# Altium project PLC_Controller Card.PrjPcb (part 1 of 2)
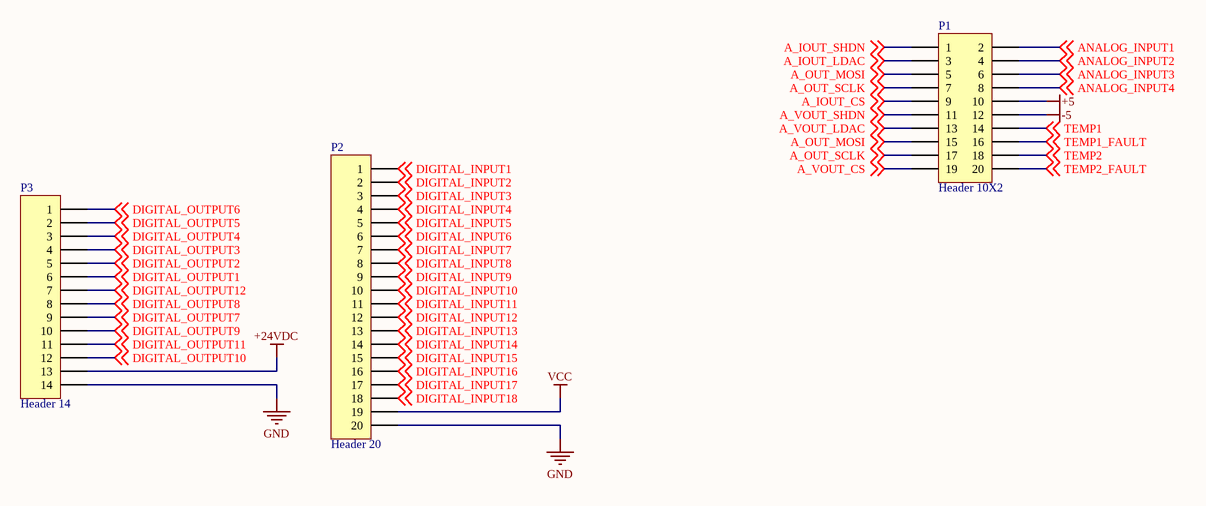
[diagram p0: Communication_with_IO.SchDoc]
8 sheets, 177 parts. Net scope: global (net labels, ports and power ports of the same name join across sheets).
Board file: Controller_PCB.PcbDoc
Sheets:
  Communication_with_IO.SchDoc
  GSM.SchDoc
  ANT.SchDoc
  GSM_INDICATION.SchDoc
  MCU.SchDoc
  Peripherals.SchDoc
  Power_supply.SchDoc
  SIM CARD.SchDoc

## Sheet Communication_with_IO.SchDoc
size A4; SheetNumber: 1; SheetTotal: 9

### Parts
P1  Header 10X2  [HDR2X10]
P2  Header 20  [HDR1X20]
P3  Header 14  [HDR1X14]

### Nets
+5: P1.10
+24VDC: P3.13
-5: P1.12
GND: P2.20 P3.14
VCC: P2.19
A_IOUT_CS: P1.9 ; off-sheet A_IOUT_CS
A_IOUT_LDAC: P1.3 ; off-sheet A_IOUT_LDAC
A_IOUT_SHDN: P1.1 ; off-sheet A_IOUT_SHDN
A_OUT_MOSI: P1.5 P1.15 ; off-sheet A_OUT_MOSI
A_OUT_SCLK: P1.7 P1.17 ; off-sheet A_OUT_SCLK
A_VOUT_CS: P1.19 ; off-sheet A_VOUT_CS
A_VOUT_LDAC: P1.13 ; off-sheet A_VOUT_LDAC
A_VOUT_SHDN: P1.11 ; off-sheet A_VOUT_SHDN
ANALOG_INPUT1: P1.2 ; off-sheet ANALOG_INPUT1
ANALOG_INPUT2: P1.4 ; off-sheet ANALOG_INPUT2
ANALOG_INPUT3: P1.6 ; off-sheet ANALOG_INPUT3
ANALOG_INPUT4: P1.8 ; off-sheet ANALOG_INPUT4
DIGITAL_INPUT1: P2.1 ; off-sheet DIGITAL_INPUT1
DIGITAL_INPUT2: P2.2 ; off-sheet DIGITAL_INPUT2
DIGITAL_INPUT3: P2.3 ; off-sheet DIGITAL_INPUT3
DIGITAL_INPUT4: P2.4 ; off-sheet DIGITAL_INPUT4
DIGITAL_INPUT5: P2.5 ; off-sheet DIGITAL_INPUT5
DIGITAL_INPUT6: P2.6 ; off-sheet DIGITAL_INPUT6
DIGITAL_INPUT7: P2.7 ; off-sheet DIGITAL_INPUT7
DIGITAL_INPUT8: P2.8 ; off-sheet DIGITAL_INPUT8
DIGITAL_INPUT9: P2.9 ; off-sheet DIGITAL_INPUT9
DIGITAL_INPUT10: P2.10 ; off-sheet DIGITAL_INPUT10
DIGITAL_INPUT11: P2.11 ; off-sheet DIGITAL_INPUT11
DIGITAL_INPUT12: P2.12 ; off-sheet DIGITAL_INPUT12
DIGITAL_INPUT13: P2.13 ; off-sheet DIGITAL_INPUT13
DIGITAL_INPUT14: P2.14 ; off-sheet DIGITAL_INPUT14
DIGITAL_INPUT15: P2.15 ; off-sheet DIGITAL_INPUT15
DIGITAL_INPUT16: P2.16 ; off-sheet DIGITAL_INPUT16
DIGITAL_INPUT17: P2.17 ; off-sheet DIGITAL_INPUT17
DIGITAL_INPUT18: P2.18 ; off-sheet DIGITAL_INPUT18
DIGITAL_OUTPUT1: P3.6 ; off-sheet DIGITAL_OUTPUT1
DIGITAL_OUTPUT2: P3.5 ; off-sheet DIGITAL_OUTPUT2
DIGITAL_OUTPUT3: P3.4 ; off-sheet DIGITAL_OUTPUT3
DIGITAL_OUTPUT4: P3.3 ; off-sheet DIGITAL_OUTPUT4
DIGITAL_OUTPUT5: P3.2 ; off-sheet DIGITAL_OUTPUT5
DIGITAL_OUTPUT6: P3.1 ; off-sheet DIGITAL_OUTPUT6
DIGITAL_OUTPUT7: P3.9 ; off-sheet DIGITAL_OUTPUT7
DIGITAL_OUTPUT8: P3.8 ; off-sheet DIGITAL_OUTPUT8
DIGITAL_OUTPUT9: P3.10 ; off-sheet DIGITAL_OUTPUT9
DIGITAL_OUTPUT10: P3.12 ; off-sheet DIGITAL_OUTPUT10
DIGITAL_OUTPUT11: P3.11 ; off-sheet DIGITAL_OUTPUT11
DIGITAL_OUTPUT12: P3.7 ; off-sheet DIGITAL_OUTPUT12
TEMP1: P1.14 ; off-sheet TEMP1
TEMP1_FAULT: P1.16 ; off-sheet TEMP1_FAULT
TEMP2: P1.18 ; off-sheet TEMP2
TEMP2_FAULT: P1.20 ; off-sheet TEMP2_FAULT

### Library data of the parts
P1 = Header 10X2: Header, 10-Pin, Dual row; LatestRevisionDate: 17-Jul-2002; LatestRevisionNote: Re-released for DXP Platform.; Publisher: Altium Limited
P2 = Header 20: Header, 20-Pin; LatestRevisionDate: 17-Jul-2002; LatestRevisionNote: Re-released for DXP Platform.; Publisher: Altium Limited
P3 = Header 14: Header, 14-Pin; LatestRevisionDate: 17-Jul-2002; LatestRevisionNote: Re-released for DXP Platform.; Publisher: Altium Limited

## Sheet GSM.SchDoc: IoT_Gateway
size A4; Date: *******; ApprovedBy: *******; CheckedBy: Parth Patel; Author: *******; CompanyName: *******; DrawnBy: Parth Patel; Engineer: *******; Organization: *******; Address1: *******; Address2: *******; Address3: *******; Address4: *******; DocumentNumber: 1; Revision: *******; SheetNumber: 2; SheetTotal: 9; Version: V1.0.0; CurrentTime: *******; CurrentDate: *******; Time: *******; DocumentFullPathAndName: *******; DocumentName: *******; ModifiedDate: *******; ImagePath: *******; ProjectName: *******; Application_BuildNumber: *******
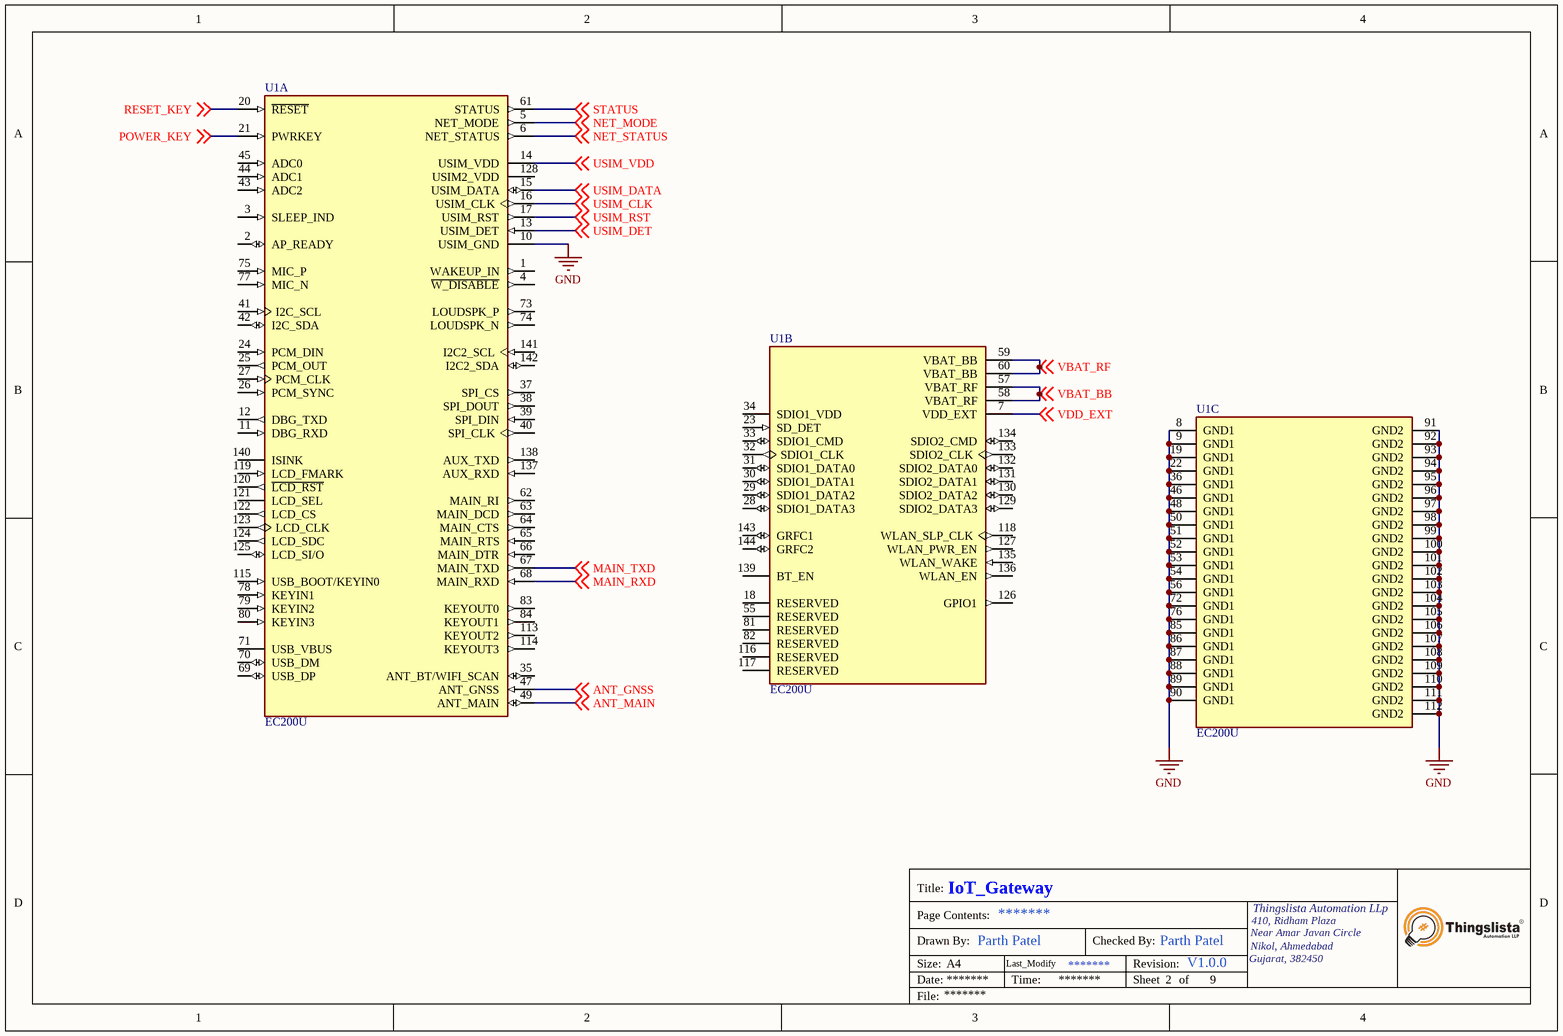
[diagram p1: GSM.SchDoc]

### Parts
U1  EC200U  [XCVR_EC200U]  (parts A,B,C of 3)

### Nets
GND: U1.8(GND1) U1.9(GND1) U1.10(USIM_GND) U1.19(GND1) U1.22(GND1) U1.36(GND1) U1.46(GND1) U1.48(GND1) U1.50(GND1) U1.51(GND1) U1.52(GND1) U1.53(GND1) U1.54(GND1) U1.56(GND1) U1.72(GND1) U1.76(GND1) U1.85(GND1) U1.86(GND1) U1.87(GND1) U1.88(GND1) U1.89(GND1) U1.90(GND1) U1.91(GND2) U1.92(GND2) U1.93(GND2) U1.94(GND2) U1.95(GND2) U1.96(GND2) U1.97(GND2) U1.98(GND2) U1.99(GND2) U1.100(GND2) U1.101(GND2) U1.102(GND2) U1.103(GND2) U1.104(GND2) U1.105(GND2) U1.106(GND2) U1.107(GND2) U1.108(GND2) U1.109(GND2) U1.110(GND2) U1.111(GND2) U1.112(GND2)
ANT_GNSS: U1.47(ANT_GNSS) ; off-sheet ANT_GNSS
ANT_MAIN: U1.49(ANT_MAIN) ; off-sheet ANT_MAIN
MAIN_RXD: U1.68(MAIN_RXD) ; off-sheet MAIN_RXD
MAIN_TXD: U1.67(MAIN_TXD) ; off-sheet MAIN_TXD
NET_MODE: U1.5(NET_MODE) ; off-sheet NET_MODE
NET_STATUS: U1.6(NET_STATUS) ; off-sheet NET_STATUS
POWER_KEY: U1.21(PWRKEY) ; off-sheet POWER_KEY
RESET_KEY: U1.20(~{RESET}) ; off-sheet RESET_KEY
STATUS: U1.61(STATUS) ; off-sheet STATUS
USIM_CLK: U1.16(USIM_CLK) ; off-sheet USIM_CLK
USIM_DATA: U1.15(USIM_DATA) ; off-sheet USIM_DATA
USIM_DET: U1.13(USIM_DET) ; off-sheet USIM_DET
USIM_RST: U1.17(USIM_RST) ; off-sheet USIM_RST
USIM_VDD: U1.14(USIM_VDD) ; off-sheet USIM_VDD
VBAT_BB: U1.57(VBAT_RF) U1.58(VBAT_RF) U1.59(VBAT_BB) U1.60(VBAT_BB) ; off-sheet VBAT_RF, off-sheet VBAT_BB  [also labelled VBAT_RF]
VDD_EXT: U1.7(VDD_EXT) ; off-sheet VDD_EXT

Not connected (* = marked no-connect by the designer): U1 1(WAKEUP_IN) 2(AP_READY) 3(SLEEP_IND) 4(~{W_DISABLE}) 11(DBG_RXD) 12(DBG_TXD) 18(RESERVED) 23(SD_DET) 24(PCM_DIN) 25(PCM_OUT) 26(PCM_SYNC) 27(PCM_CLK) 28(SDIO1_DATA3) 29(SDIO1_DATA2) 30(SDIO1_DATA1) 31(SDIO1_DATA0) 32(SDIO1_CLK) 33(SDIO1_CMD) 34(SDIO1_VDD) 35(ANT_BT/WIFI_SCAN) 37(SPI_CS) 38(SPI_DOUT) 39(SPI_DIN) 40(SPI_CLK) 41(I2C_SCL) 42(I2C_SDA) 43(ADC2) 44(ADC1) 45(ADC0) 55(RESERVED) 62(MAIN_RI) 63(MAIN_DCD) 64(MAIN_CTS) 65(MAIN_RTS) 66(MAIN_DTR) 69(USB_DP) 70(USB_DM) 71(USB_VBUS) 73(LOUDSPK_P) 74(LOUDSPK_N) 75(MIC_P) 77(MIC_N) 78(KEYIN1) 79(KEYIN2) 80(KEYIN3) 81(RESERVED) 82(RESERVED) 83(KEYOUT0) 84(KEYOUT1) 113(KEYOUT2) 114(KEYOUT3) 115(USB_BOOT/KEYIN0) 116(RESERVED) 117(RESERVED) 118(WLAN_SLP_CLK) 119(LCD_FMARK) 120(~{LCD_RST}) 121(LCD_SEL) 122(LCD_CS) 123(LCD_CLK) 124(LCD_SDC) 125(LCD_SI/O) 126(GPIO1) 127(WLAN_PWR_EN) 128(USIM2_VDD) 129(SDIO2_DATA3) 130(SDIO2_DATA2) 131(SDIO2_DATA1) 132(SDIO2_DATA0) 133(SDIO2_CLK) 134(SDIO2_CMD) 135(WLAN_WAKE) 136(WLAN_EN) 137(AUX_RXD) 138(AUX_TXD) 139(BT_EN) 140(ISINK) 141(I2C2_SCL) 142(I2C2_SDA) 143(GRFC1) 144(GRFC2)

### Notes on the sheet
- Title:
- Page Contents:
- 410, Ridham Plaza
- Thingslista Automation LLp
- Size:
- Date:
- File:
- Drawn By:
- A4
- Last_Modify
- Time:
- Checked By:
- Revision:
- Sheet
- of
- Gujarat, 382450
- Near Amar Javan Circle
- Nikol, Ahmedabad

### Library data of the parts
U1 = EC200U: Package: None; Price: None; Value: *; MP: EC200U; Availability: Unavailable

## Sheet ANT.SchDoc: Title
size A4; Date: *******; ApprovedBy: *******; CheckedBy: None; Author: *******; CompanyName: *******; DrawnBy: Name; Engineer: *******; Organization: *******; Address1: *******; Address2: *******; Address3: *******; Address4: *******; DocumentNumber: 5; Revision: *******; SheetNumber: 3; SheetTotal: 9; CurrentTime: *******; CurrentDate: *******; Time: *******; DocumentFullPathAndName: *******; DocumentName: *******; ModifiedDate: *******; ImagePath: *******; ProjectName: *******; Application_BuildNumber: *******
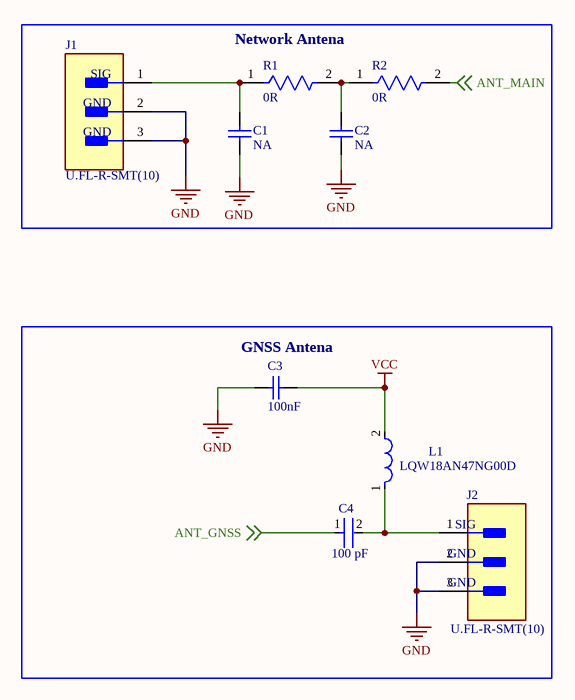
[diagram p2: ANT.SchDoc]

### Parts
C1  NA  [CAPC2013X145X50ML20T25]
C2  NA  [CAPC2013X145X50ML20T25]
C3  Capacitance: 100nF  [CAPC2013X135X45ML10T25]  (hidden comment: GRM21BR71H104KA01L)
C4  Capacitance: 100 pF  [FP-C0805C-DN-MFG]  (hidden comment: C0805C101J1GACTU)
J1  U.FL-R-SMT(10)  [FP-U_FL-R-SMT_10-MFG]
J2  U.FL-R-SMT(10)  [FP-U_FL-R-SMT_10-MFG]
L1  LQW18AN47NG00D  [FP-LQW18AN_00-MFG]
R1  0R  [FP-CRCW0805-e3-IPC_B]
R2  0R  [FP-CRCW0805-e3-IPC_B]

### Blocks framed on the sheet
Network Antena: C1 C2 J1 R1 R2
GNSS Antena: C3 C4 J2 L1

### Nets
GND: C1.1 C2.1 C3.1 J1.2(GND) J1.3(GND) J2.2(GND) J2.3(GND)
VCC: C3.2 L1.2
ANT_GNSS: C4.1 ; off-sheet ANT_GNSS
ANT_MAIN: R2.2 ; off-sheet ANT_MAIN
NetC1_2: C1.2 J1.1(SIG) R1.1
NetC2_2: C2.2 R1.2 R2.1
NetC4_2: C4.2 J2.1(SIG) L1.1

### Notes on the sheet
- Title:
- Page Contents:
- 410, Ridham Plaza
- Thingslista Automation LLp
- Size:
- Date:
- File:
- Drawn By:
- A4
- Last_Modify
- Time:
- Checked By:
- Revision:
- Sheet
- of
- Gujarat, 382450
- Near Amar Javan Circle
- Nikol, Ahmedabad

### Library data of the parts
C1 C2 = CMP-1036-04819-2: Part Number: C0805C225K9PACTU; Manufacturer: Kemet
C3 = CMP-2100-03644-1: Chip Capacitor, 0.1 uF, +/- 10%, 50 V, -55 to 125 degC, 0805 (2012 Metric), RoHS, Tape and Reel; Manufacturer: Murata; Voltage: 50V; Insulation Resistance: 10GR; Dielectric Material: Ceramic; Dielectric: X7R; Package Description: 2-Pin Surface Mount Device, Body 2 x 1.25 mm; Manufacturer URL: http://www.murata.com/; Case Code (Imperial): 0805; Datasheet URL: http://psearch.en.murata.com/capacitor/product/GRM21BR71H104KA01%23.pdf; Termination: SMD/SMT; Lead Free: LeadFree; Package Quantity: 1; Mount: SurfaceMount; REACH SVHC: Unknown; Thickness: 0.053inch; Height: 1.25mm; Case/Package: 0805; Voltage Rating: 50V; Width: 0.049inch; Case Code (Metric): 2012; Material: Ceramic; Min Operating Temperature: -55degC; RoHSCompliant: true; Datasheet Version: 42675.0; Voltage Rating (DC): 50V; Tolerance: 10%; Package Reference: 0805; Depth: 1.25mm; Length: 2mm; Max Operating Temperature: 125degC; Packaging: TapeandReel; Number of Pins: 2; Radiation Hardening: No
C4 = CMP-03020-014281-1: CAP CER 100PF 100V C0G/NP0 0805; Manufacturer: KEMET; Temperature Coefficient: 30ppm/°C; Temperature Characteristic: C0G; Material: Ceramic; Tolerance: 0.05; RoHS: TRUE; ComponentLink2URL: https://content.kemet.com/datasheets/KEM_C1003_C0G_SMD.pdf; Voltage Rating: 100 V; Height: 0.88mm; Device Class L3: Ceramic Capacitors; Temperature: -55°C to +125°C; Manufacturer Part Number: C0805C101J1GACTU; Digikey Description: CAP CER 100PF 100V C0G/NP0 0805; Device Class L1: Passive Components; Lead Free: Yes; Package: C0805C-DN; Octopart: https://octopart.com/c0805c101j1gactu-kemet-123666; Automotive: No; Category: Cap; Temperature Range High: +125°C; Mouser Description: Multilayer Ceramic Capacitors MLCC - SMD/SMT 100volts 100pF C0G 5%; Temperature Range Low: -55°C; ComponentLink2Description: Datasheet; Ipc Land Pattern Name: CAPC200125X78; Device Class L2: Capacitors; Value: 100 pF
J1 J2 = CMP-0029-00003-2: CONN U.FL RCPT STR 50 OHM SMD; Plating: Silver; Connector Type: Coaxial; Frequency: 6GHz; Impedance: 50R; Body Material: Bronze; Dielectric Material: Polymer; Contact Plating: Gold; Termination: Solder; Orientation: Vertical; Contact Material: Brass; Min Operating Temperature: -40°C; Mount: Surface Mount; Lead Free: Lead Free; Max Operating Temperature: 90°C; Radiation Hardening: No; Packaging: Tape and Reel; Body Plating: Silver; Fastening Type: Snap; Max Frequency: 6GHz; Depth: 3.1mm; Package Quantity: 1; Case/Package: SMD/SMT; Housing Color: Beige; Length: 3mm
L1 = CMP-06042-007966-1: Wire Wound RF Inductor 47nH ±2% 380mA 0.29Ω 0603 (1608); Self Resonant Frequency: 2.6GHz; DC Resistance (DCR): 290mR; Test Frequency: 100MHz; Q Factor: 38; Shielding: Unshielded; Current: 340mA; Core Material: Non-Magnetic; Weight: 0.000106oz; Depth: 1mm; Resistor Type: Wirewound; Max Operating Temperature: 125°C; Inductance: 47nH; Mount: Surface Mount; DC Current: 380mA; Tolerance: 2%; Height - Seated (Max): 0.039inch; Height: 0.8mm; Radiation Hardening: No; Package Quantity: 4000; Case/Package: 0603; Military Standard: Not; Series Resistance: 290mR; Termination: SMD/SMT; Max DC Current: 380mA; Packaging: Tape and Reel; Min Operating Temperature: -55°C; Case Code (Metric): 1608; REACH SVHC: No SVHC; Lead Free: Lead Free; Inductance Tolerance: 2%; Case Code (Imperial): 0603; Length: 1.6mm; Width: 0.8mm; Number of Pins: 2; Current Rating: 380mA
R1 R2 = CMP-2001-04897-2: RES Thick Film, 0Ω, 0.125W, 0805; Power Rating: 125mW; Resistance: 0mR; Voltage Rating: 150V; Length: 2mm; Width: 0.049inch; Weight: 0.000194oz; Composition: Thick Film; Contact Plating: Tin; Max Power Dissipation: 125mW; Min Operating Temperature: -55°C; Packaging: Tape and Reel; Number of Terminations: 2; Package Quantity: 10000; Case Code (Imperial): 0805; Military Standard: Not; Height: 0.02inch; Features: Automotive AEC-Q200; Depth: 1.25mm; Radiation Hardening: No; Lead Free: Lead Free; Case Code (Metric): 2012; Case/Package: 0805; Voltage Rating (DC): 150V; Termination: SMD/SMT; Max Operating Temperature: 155°C

## Sheet GSM_INDICATION.SchDoc: Title
size A4; Date: *******; ApprovedBy: *******; CheckedBy: None; Author: *******; CompanyName: *******; DrawnBy: Name; Engineer: *******; Organization: *******; Address1: *******; Address2: *******; Address3: *******; Address4: *******; DocumentNumber: 3; Revision: *******; SheetNumber: 4; SheetTotal: 9; CurrentTime: *******; CurrentDate: *******; Time: *******; DocumentFullPathAndName: *******; DocumentName: *******; ModifiedDate: *******; ImagePath: *******; ProjectName: *******; Application_BuildNumber: *******
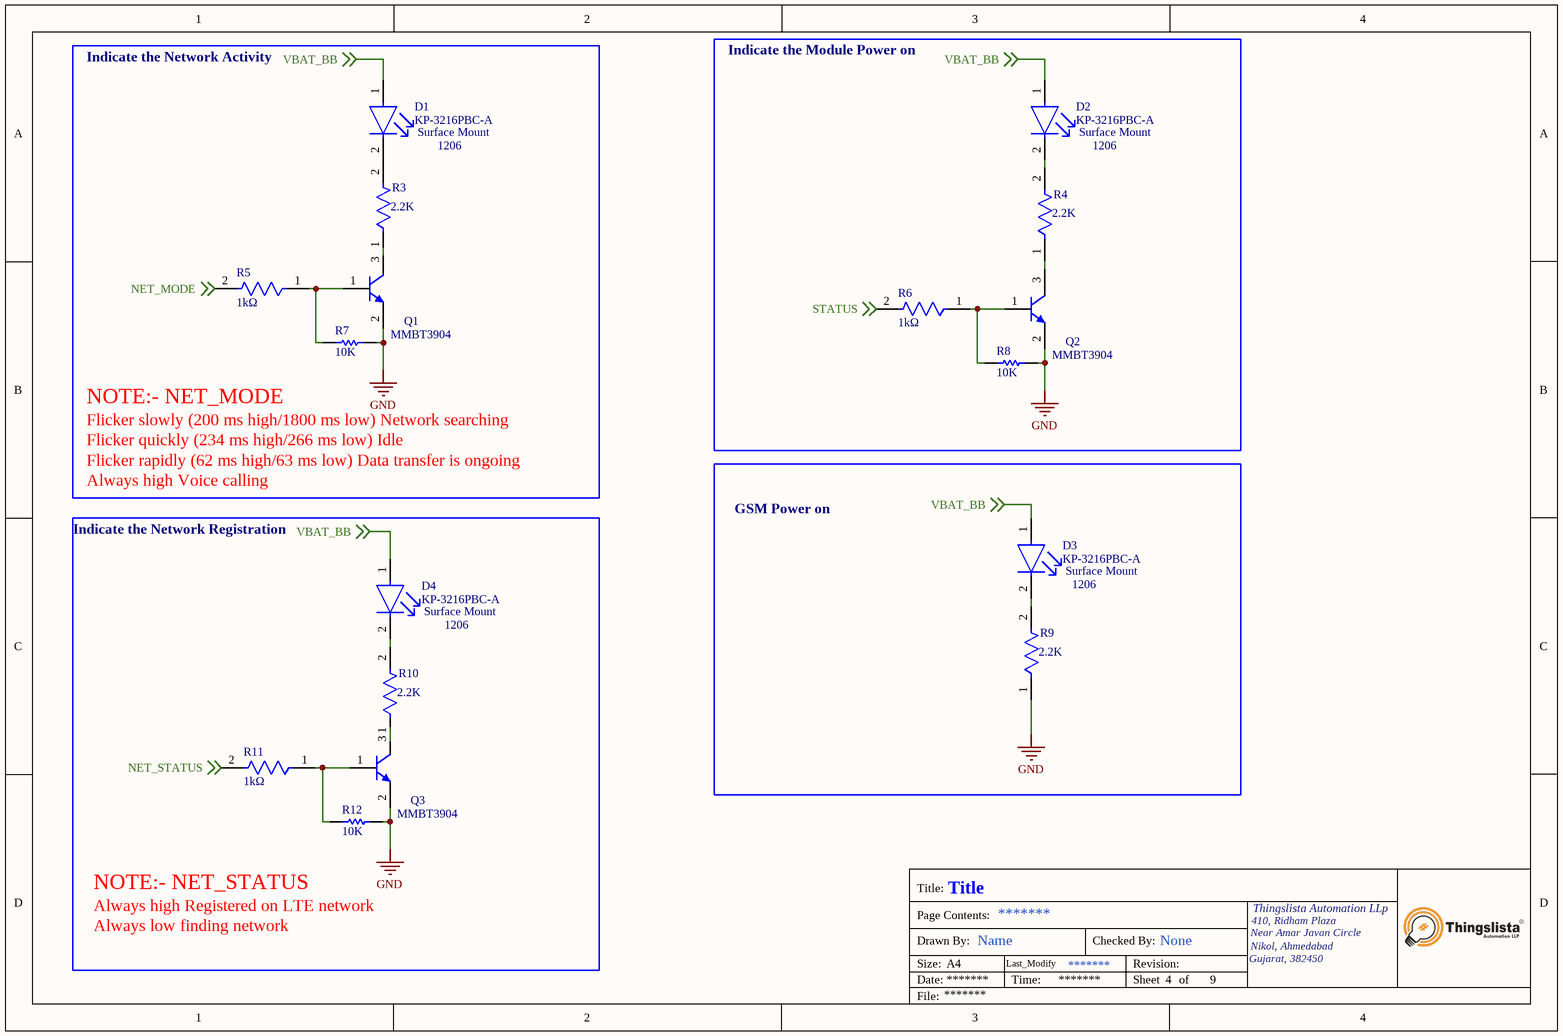
[diagram p3: GSM_INDICATION.SchDoc]

### Parts
D1  KP-3216PBC-A  Series: 1206  Mount: Surface Mount  [FP-KP-3216PBC-A-MFG]
D2  KP-3216PBC-A  Series: 1206  Mount: Surface Mount  [FP-KP-3216PBC-A-MFG]
D3  KP-3216PBC-A  Series: 1206  Mount: Surface Mount  [FP-KP-3216PBC-A-MFG]
D4  KP-3216PBC-A  Series: 1206  Mount: Surface Mount  [FP-KP-3216PBC-A-MFG]
Q1  MMBT3904  [FAIR-SOT23-3_V]
Q2  MMBT3904  [FAIR-SOT23-3_V]
Q3  MMBT3904  [FAIR-SOT23-3_V]
R3  Resistance: 2.2K  [FP-CRCW0805-e3-IPC_B]  (hidden comment: CRCW08052K20FKEA)
R4  Resistance: 2.2K  [FP-CRCW0805-e3-IPC_B]  (hidden comment: CRCW08052K20FKEA)
R5  Resistance: 1kΩ  [FP-CRG0805-IPC_A]  (hidden comment: CRG0805F1K0)
R6  Resistance: 1kΩ  [FP-CRG0805-IPC_A]  (hidden comment: CRG0805F1K0)
R7  value 10K  [RESC2013X60X35NL10T20]  (hidden comment: RC0805FR-0710KL)
R8  value 10K  [RESC2013X60X35NL10T20]  (hidden comment: RC0805FR-0710KL)
R9  Resistance: 2.2K  [FP-CRCW0805-e3-IPC_B]  (hidden comment: CRCW08052K20FKEA)
R10  Resistance: 2.2K  [FP-CRCW0805-e3-IPC_B]  (hidden comment: CRCW08052K20FKEA)
R11  Resistance: 1kΩ  [FP-CRG0805-IPC_A]  (hidden comment: CRG0805F1K0)
R12  value 10K  [RESC2013X60X35NL10T20]  (hidden comment: RC0805FR-0710KL)

### Blocks framed on the sheet
NOTE:- NET_MODE: D1 Q1 R3 R5 R7
Indicate the Module Power on: D2 Q2 R4 R6 R8
NOTE:- NET_STATUS: D4 Q3 R10-R12
GSM Power on: D3 R9

### Nets
GND: Q1.2(E) Q2.2(E) Q3.2(E) R7.1 R8.1 R9.1 R12.1
NET_MODE: R5.2 ; off-sheet NET_MODE
NET_STATUS: R11.2 ; off-sheet NET_STATUS
STATUS: R6.2 ; off-sheet STATUS
VBAT_BB: D1.1(A) D2.1(A) D3.1(A) D4.1(A) ; off-sheet VBAT_BB
NetD1_2: D1.2(C) R3.2
NetD2_2: D2.2(C) R4.2
NetD3_2: D3.2(C) R9.2
NetD4_2: D4.2(C) R10.2
NetQ1_1: Q1.1(B) R5.1 R7.2
NetQ1_3: Q1.3(C) R3.1
NetQ2_1: Q2.1(B) R6.1 R8.2
NetQ2_3: Q2.3(C) R4.1
NetQ3_1: Q3.1(B) R11.1 R12.2
NetQ3_3: Q3.3(C) R10.1

### Notes on the sheet
- Indicate the Network Activity
- Flicker slowly (200 ms high/1800 ms low) Network searching
- Flicker quickly (234 ms high/266 ms low) Idle
- Flicker rapidly (62 ms high/63 ms low) Data transfer is ongoing
- Always high Voice calling
- Indicate the Network Registration
- Always high Registered on LTE network
- Always low finding network
- Title:
- Page Contents:
- 410, Ridham Plaza
- Thingslista Automation LLp
- Size:
- Date:
- File:
- Drawn By:
- A4
- Last_Modify
- Time:
- Checked By:
- Revision:
- Sheet
- of
- Gujarat, 382450
- Near Amar Javan Circle
- Nikol, Ahmedabad

### Library data of the parts
D1-D4 = CMP-44529-000052-1: LED, Low Power, Blue, SMD, 1.6mm x 2mm, 20 mA, 3.2 V, 470 nm; Forward Voltage: 3.2V; Wavelength: 470nm; Luminous Intensity: 60mcd; Lens Color: Clear; Forward Current: 20mA; Viewing Angle: 120°; Number of LEDs: 1; Lens Style: Rectangular; Color: Blue; Case/Package: 3216; Dominant Wavelength: 470nm; RoHS Compliant: No; Packaging: Cut Tape; Number of Pins: 2; REACH SVHC: No SVHC
Q1-Q3 = CMP-1670-00008-1: NPN General Purpose Amplifier, 40 V, 0.2 A, -55 to 150 degC, 3-Pin SOT23, RoHS, Tape and Reel; Tolerance: 30ppm; Capacitance: 1.8E-11 f; Frequency: 12.288 MHz; ESR: 40 Ohm; Load Capacitance: 18 pF; REACH SVHC: No SVHC; Pins: 4; ComponentLink3URL: http://www.fairchildsemi.com/dwg/MA/MA03D.pdf; PackageDescription: 3-Pin Small Outline Transistor, Body 2.92 x 1.325 mm, Pitch 0.95 mm; ComponentLink1URL: https://www.fairchildsemi.com/; Max Operating Temperature: 70degC; PackageReference: SOT23-3; ComponentLink1Description: Manufacturer URL; Width: 0.126 inch; Min Operating Temperature: -20degC; DatasheetVersion: Rev. 1.1.0, 10/2014; Mount: Surface Mount; Height: 0.041 inch; Package Quantity: 1000; Frequency Tolerance: 30ppm; Packaging: Tape and Reel; ComponentLink2URL: https://www.fairchildsemi.com/datasheets/MM/MMBT3904.pdf; RoHSCompliant: True; ComponentLink3Description: Package Specification; ComponentLink2Description: Datasheet; Length: 0.197 inch
R3 R4 R9 R10 = CMP-2001-03760-2: RES Thick Film, 2.2kΩ, 1%, 0.125W, 100ppm/°C, 0805; Voltage Rating (DC): 150V; Max Power Dissipation: 125mW; Case/Package: 0805; Width: 1.25mm; Voltage Rating: 150V; Composition: Thick Film; Power Rating: 125mW; Packaging: Tape and Reel; Min Operating Temperature: -55°C; Contact Plating: Tin; Tolerance: 1%; Military Standard: Not; Case Code (Metric): 2012; Radiation Hardening: No; Termination: SMD/SMT; Lead Free: Lead Free; Case Code (Imperial): 0805; Max Operating Temperature: 155°C; Depth: 1.25mm; Weight: 0.000194oz; Number of Terminations: 2; Length: 2mm; Package Quantity: 10; Temperature Coefficient: 100ppm/°C; Features: Automotive AEC-Q200; Height: 0.45mm
R5 R6 R11 = CMP-03790-16077480-1: CRG0805F1K0 Thick Film Resistors - SMD 1K Ohm 1% 1/8W Res Thick Film 0805; Manufacturer Lifecycle Status: ACTIVE; Max Power Dissipation: 125mW; Voltage Rating: 150V; Number of Resistors: 1; Temperature Coefficient: 100ppm/°C; ELV: Compliant; Case/Package: 0805; Number of Terminations: 2; Termination: SMD/SMT, Solder; Composition: Thick Film; Voltage Rating (DC): 150V; Min Operating Temperature: -55°C; Tolerance: 1%; Case Code (Imperial): 0805; Power Rating: 125mW; Schedule B: 8533210045, 8533210090, 8533210090; Case Code (Metric): 2012; NexarPartId: 16077480; Packaging: Tape and Reel; Lifecycle Status: Production; Depth: 1.25mm; Mount: Surface Mount; Weight: 5.499807mg; Radiation Hardening: No; Max Operating Temperature: 125°C; Width: 1.2446mm; Length: 2mm; Military Standard: Not; RoHS: Compliant; Height: 550µm
R7 R8 R12 = CMP-1659-00013-4: Chip Resistor, 10 KOhm, +/- 1%, 0.125 W, -55 to 155 degC, 0805 (2012 Metric), RoHS, Tape and Reel; Manufacturer: Yageo; Voltage Rating: 150 V; Mount: Surface Mount; ComponentLink1Description: Manufacturer URL; ComponentLink2URL: http://www.yageo.com/documents/recent/PYu-RC_Group_51_RoHS_L_04.pdf; Pins: 2; Length: 2 mm; Min Operating Temperature: -55 degC; Height: 0.5 mm; Mounting Technology: Surface Mount; RoHSCompliant: true; REACH SVHC: No SVHC; ComponentLink1URL: http://www.yageo.com/; Max Operating Temperature: 155 degC; PackageReference: 0805; DatasheetVersion: Rev. 4, 02/2016; Package Quantity: 5000; Packaging: Tape and Reel; ComponentLink2Description: Datasheet; PackageDescription: 2-Pin Surface Mounted Device, Body 2 x 1.25 mm

## Sheet MCU.SchDoc
size A4; SheetNumber: 5; SheetTotal: 9
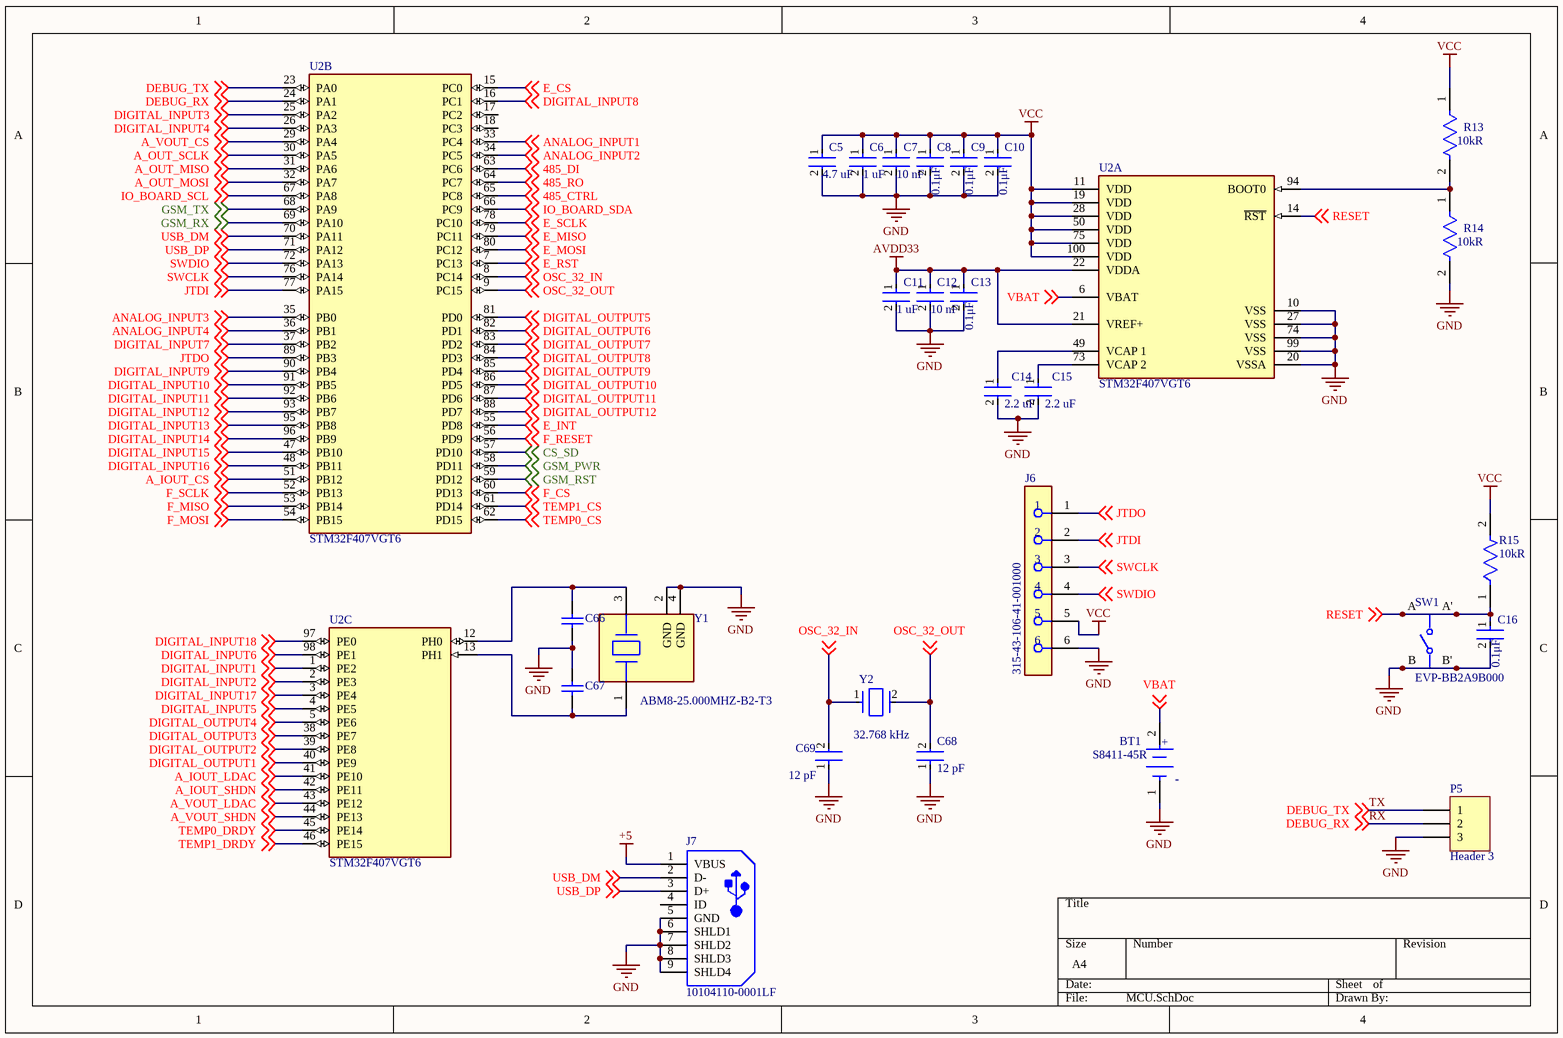
[diagram p4: MCU.SchDoc]

### Parts
BT1  S8411-45R  [FP-S8411-45R-MFG]
C5  value 4.7 uF  [FP-CC0603-DA-MFG]  (hidden comment: CC0603KRX5R8BB475)
C6  value 1 uF  [FP-CC0603-DA-MFG]  (hidden comment: CC0603KRX7R6BB105)
C7  value 10 nF  [FP-CC0603-DA-MFG]  (hidden comment: CC0603KRX7R6BB103)
C8  value 0.1μF  [FP-C0603C-CF-MFG]  (hidden comment: C0603C104K8PAC7867)
C9  value 0.1μF  [FP-C0603C-CF-MFG]  (hidden comment: C0603C104K8PAC7867)
C10  value 0.1μF  [FP-C0603C-CF-MFG]  (hidden comment: C0603C104K8PAC7867)
C11  value 1 uF  [FP-CC0603-DA-MFG]  (hidden comment: CC0603KRX7R6BB105)
C12  value 10 nF  [FP-CC0603-DA-MFG]  (hidden comment: CC0603KRX7R6BB103)
C13  value 0.1μF  [FP-C0603C-CF-MFG]  (hidden comment: C0603C104K8PAC7867)
C14  value 2.2 uF  [FP-CC0603-DA-MFG]  (hidden comment: CC0603KPX5R5BB225)
C15  value 2.2 uF  [FP-CC0603-DA-MFG]  (hidden comment: CC0603KPX5R5BB225)
C16  value 0.1μF  [FP-C0603C-CF-MFG]  (hidden comment: C0603C104K8PAC7867)
C66  VJ0603A180JXAAC  [CAPC1608X92X38ML15T08]  (value not drawn)
C67  VJ0603A180JXAAC  [CAPC1608X92X38ML15T08]  (value not drawn)
C68  value 12 pF  [FP-C0603C-CF-MFG]  (hidden comment: C0603C120C5GAC7867)
C69  value 12 pF  [FP-C0603C-CF-MFG]  (hidden comment: C0603C120C5GAC7867)
J6  315-43-106-41-001000  [FP-315-43-106-41-001000-MFG]
J7  10104110-0001LF  [FCI-10104110-0001LF_V]
P5  Header 3  [HDR1X3]
R13  Resistance: 10kR  [FP-CRCW0603-e3-IPC_A]  (hidden comment: CRCW060310K0FKED)
R14  Resistance: 10kR  [FP-CRCW0603-e3-IPC_A]  (hidden comment: CRCW060310K0FKED)
R15  Resistance: 10kR  [FP-CRCW0603-e3-IPC_A]  (hidden comment: CRCW060310K0FKED)
SW1  EVP-BB2A9B000  [FP-EVP-BB2A9B000-MFG]
U2  STM32F407VGT6  [FP-LQFP100-1L-IPC_A]  (parts A,B,C of 3)
Y1  ABM8-25.000MHZ-B2-T3  [FP-ABM8-MFG]
Y2  Operating Frequency: 32.768 kHz  [FP-ABS09-MFG]  (hidden comment: ABS09-32.768KHZ-1-T)

### Nets
+5: J7.1(VBUS)
AVDD33: C11.1 C12.1 C13.1 U2.21(VREF+) U2.22(VDDA)
GND: BT1.1(C) C5.2 C6.2 C7.2 C8.2 C9.2 C10.2 C11.2 C12.2 C13.2 C14.2 C15.2 C16.2 C66.2 C67.1 C68.1 C69.1 J6.6 J7.5(GND) J7.6(SHLD1) J7.7(SHLD2) J7.8(SHLD3) J7.9(SHLD4) P5.3 R14.2 SW1.B SW1.B' U2.10(VSS) U2.20(VSSA) U2.27(VSS) U2.74(VSS) U2.99(VSS) Y1.2(GND) Y1.4(GND)
VCC: C5.1 C6.1 C7.1 C8.1 C9.1 C10.1 J6.5 R13.1 R15.2 U2.11(VDD) U2.19(VDD) U2.28(VDD) U2.50(VDD) U2.75(VDD) U2.100(VDD)
485_CTRL: U2.65(PC8) ; off-sheet 485_CTRL
485_DI: U2.63(PC6) ; off-sheet 485_DI
485_RO: U2.64(PC7) ; off-sheet 485_RO
A_IOUT_CS: U2.51(PB12) ; off-sheet A_IOUT_CS
A_IOUT_LDAC: U2.41(PE10) ; off-sheet A_IOUT_LDAC
A_IOUT_SHDN: U2.42(PE11) ; off-sheet A_IOUT_SHDN
A_OUT_MISO: U2.31(PA6) ; off-sheet A_OUT_MISO
A_OUT_MOSI: U2.32(PA7) ; off-sheet A_OUT_MOSI
A_OUT_SCLK: U2.30(PA5) ; off-sheet A_OUT_SCLK
A_VOUT_CS: U2.29(PA4) ; off-sheet A_VOUT_CS
A_VOUT_LDAC: U2.43(PE12) ; off-sheet A_VOUT_LDAC
A_VOUT_SHDN: U2.44(PE13) ; off-sheet A_VOUT_SHDN
ANALOG_INPUT1: U2.33(PC4) ; off-sheet ANALOG_INPUT1
ANALOG_INPUT2: U2.34(PC5) ; off-sheet ANALOG_INPUT2
ANALOG_INPUT3: U2.35(PB0) ; off-sheet ANALOG_INPUT3
ANALOG_INPUT4: U2.36(PB1) ; off-sheet ANALOG_INPUT4
CS_SD: U2.57(PD10) ; off-sheet CS_SD
DIGITAL_INPUT1: U2.1(PE2) ; off-sheet DIGITAL_INPUT1
DIGITAL_INPUT2: U2.2(PE3) ; off-sheet DIGITAL_INPUT2
DIGITAL_INPUT3: U2.25(PA2) ; off-sheet DIGITAL_INPUT3
DIGITAL_INPUT4: U2.26(PA3) ; off-sheet DIGITAL_INPUT4
DIGITAL_INPUT5: U2.4(PE5) ; off-sheet DIGITAL_INPUT5
DIGITAL_INPUT6: U2.98(PE1) ; off-sheet DIGITAL_INPUT6
DIGITAL_INPUT7: U2.37(PB2) ; off-sheet DIGITAL_INPUT7
DIGITAL_INPUT8: U2.16(PC1) ; off-sheet DIGITAL_INPUT8
DIGITAL_INPUT9: U2.90(PB4) ; off-sheet DIGITAL_INPUT9
DIGITAL_INPUT10: U2.91(PB5) ; off-sheet DIGITAL_INPUT10
DIGITAL_INPUT11: U2.92(PB6) ; off-sheet DIGITAL_INPUT11
DIGITAL_INPUT12: U2.93(PB7) ; off-sheet DIGITAL_INPUT12
DIGITAL_INPUT13: U2.95(PB8) ; off-sheet DIGITAL_INPUT13
DIGITAL_INPUT14: U2.96(PB9) ; off-sheet DIGITAL_INPUT14
DIGITAL_INPUT15: U2.47(PB10) ; off-sheet DIGITAL_INPUT15
DIGITAL_INPUT16: U2.48(PB11) ; off-sheet DIGITAL_INPUT16
DIGITAL_INPUT17: U2.3(PE4) ; off-sheet DIGITAL_INPUT17
DIGITAL_INPUT18: U2.97(PE0) ; off-sheet DIGITAL_INPUT18
DIGITAL_OUTPUT1: U2.40(PE9) ; off-sheet DIGITAL_OUTPUT1
DIGITAL_OUTPUT2: U2.39(PE8) ; off-sheet DIGITAL_OUTPUT2
DIGITAL_OUTPUT3: U2.38(PE7) ; off-sheet DIGITAL_OUTPUT3
DIGITAL_OUTPUT4: U2.5(PE6) ; off-sheet DIGITAL_OUTPUT4
DIGITAL_OUTPUT5: U2.81(PD0) ; off-sheet DIGITAL_OUTPUT5
DIGITAL_OUTPUT6: U2.82(PD1) ; off-sheet DIGITAL_OUTPUT6
DIGITAL_OUTPUT7: U2.83(PD2) ; off-sheet DIGITAL_OUTPUT7
DIGITAL_OUTPUT8: U2.84(PD3) ; off-sheet DIGITAL_OUTPUT8
DIGITAL_OUTPUT9: U2.85(PD4) ; off-sheet DIGITAL_OUTPUT9
DIGITAL_OUTPUT10: U2.86(PD5) ; off-sheet DIGITAL_OUTPUT10
DIGITAL_OUTPUT11: U2.87(PD6) ; off-sheet DIGITAL_OUTPUT11
DIGITAL_OUTPUT12: U2.88(PD7) ; off-sheet DIGITAL_OUTPUT12
E_CS: U2.15(PC0) ; off-sheet E_CS
E_INT: U2.55(PD8) ; off-sheet E_INT
E_MISO: U2.79(PC11) ; off-sheet E_MISO
E_MOSI: U2.80(PC12) ; off-sheet E_MOSI
E_RST: U2.7(PC13) ; off-sheet E_RST
E_SCLK: U2.78(PC10) ; off-sheet E_SCLK
F_CS: U2.60(PD13) ; off-sheet F_CS
F_MISO: U2.53(PB14) ; off-sheet F_MISO
F_MOSI: U2.54(PB15) ; off-sheet F_MOSI
F_RESET: U2.56(PD9) ; off-sheet F_RESET
F_SCLK: U2.52(PB13) ; off-sheet F_SCLK
GSM_PWR: U2.58(PD11) ; off-sheet GSM_PWR
GSM_RST: U2.59(PD12) ; off-sheet GSM_RST
GSM_RX: U2.69(PA10) ; off-sheet GSM_RX
GSM_TX: U2.68(PA9) ; off-sheet GSM_TX
IO_BOARD_SCL: U2.67(PA8) ; off-sheet IO_BOARD_SCL
IO_BOARD_SDA: U2.66(PC9) ; off-sheet IO_BOARD_SDA
JTDI: J6.2 U2.77(PA15) ; off-sheet JTDI
JTDO: J6.1 U2.89(PB3) ; off-sheet JTDO
OSC_32_IN: C69.2 U2.8(PC14) Y2.1 ; off-sheet OSC_32_IN
OSC_32_OUT: C68.2 U2.9(PC15) Y2.2 ; off-sheet OSC_32_OUT
RESET: C16.1 R15.1 SW1.A SW1.A' U2.14(~{RST}) ; off-sheet RESET
RX: P5.2 U2.24(PA1) ; off-sheet DEBUG_RX  [also labelled DEBUG_RX]
SWCLK: J6.3 U2.76(PA14) ; off-sheet SWCLK
SWDIO: J6.4 U2.72(PA13) ; off-sheet SWDIO
TEMP0_CS: U2.62(PD15) ; off-sheet TEMP0_CS
TEMP0_DRDY: U2.45(PE14) ; off-sheet TEMP0_DRDY
TEMP1_CS: U2.61(PD14) ; off-sheet TEMP1_CS
TEMP1_DRDY: U2.46(PE15) ; off-sheet TEMP1_DRDY
TX: P5.1 U2.23(PA0) ; off-sheet DEBUG_TX  [also labelled DEBUG_TX]
USB_DM: J7.2(D-) U2.70(PA11) ; off-sheet USB_DM
USB_DP: J7.3(D+) U2.71(PA12) ; off-sheet USB_DP
VBAT: BT1.2(A) U2.6(VBAT) ; off-sheet VBAT
NetC14_1: C14.1 U2.49(VCAP_1)
NetC15_1: C15.1 U2.73(VCAP_2)
NetC66_1: C66.1 U2.12(PH0) Y1.3
NetC67_2: C67.2 U2.13(PH1) Y1.1
NetR13_2: R13.2 R14.1 U2.94(BOOT0)

Not connected (* = marked no-connect by the designer): J7 4(ID); U2 17(PC2) 18(PC3)

### Notes on the sheet
- (in symbol CMP-15817-000007-1) +; -

### Library data of the parts
BT1 = CMP-15817-000007-1: BATTERY HOLDER COIN 12MM SMD; Number of Batteries: 1; Material: Polyphenylene; Case/Package: SMD/SMT; Number of Cells: 1; Min Operating Temperature: -55°C; Termination: SMD/SMT; REACH SVHC: No SVHC; Contact Plating: Bronze; Package Quantity: 500; Max Operating Temperature: 105°C; Mount: Surface Mount; Packaging: Tape and Reel
C5 = CMP-03422-001217-1: CAP CER 4.7UF 25V X5R 0603; Manufacturer: YAGEO; Material: Ceramic; Temperature Coefficient: 15%; Tolerance: 0.1; Device Class L1: Passive Components; Temperature: -55°C to +125°C; RoHS: TRUE; Temperature Range High: +125°C; Automotive: No; Lead Free: Yes; Digikey Description: CAP CER 4.7UF 25V X5R 0603; Category: Cap; Temperature Characteristic: X5R; Manufacturer Part Number: CC0603KRX5R8BB475; Package: CC0603-DA; Device Class L2: Capacitors; Temperature Range Low: -55°C; Voltage Rating: 25 V; Capacitance: 4.7 uF; ComponentLink2URL: http://www.yageo.com/documents/recent/UPY-GPHC_X7R_6.3V-to-50V_18.pdf; Octopart: https://octopart.com/cc0603krx5r8bb475-yageo-77825350; Footprint Url: http://www.yageo.com/exep/pages/download/literatures/UPY-C_GEN_24.pdf; Device Class L3: Ceramic Capacitors; ComponentLink2Description: Datasheet; Voltage: 25 V; Height: 0.9mm
C6 C11 = CMP-03422-000835-1: CAP CER 1UF 10V X7R 0603; Manufacturer: YAGEO; Material: Ceramic; Temperature Coefficient: 15%; Tolerance: 0.1; Digikey Description: CAP CER 1UF 10V X7R 0603; Temperature: -55°C to +125°C; ComponentLink2URL: http://www.yageo.com/documents/recent/UPY-GPHC_X7R_6.3V-to-50V_18.pdf; Category: Cap; Voltage Rating: 10 V; Footprint Url: http://www.yageo.com/exep/pages/download/literatures/UPY-C_GEN_24.pdf; Mouser Description: Multilayer Ceramic Capacitors MLCC - SMD/SMT 1.0uF 10V X7R 10%; Device Class L3: Ceramic Capacitors; Temperature Characteristic: X7R; Automotive: No; Package: CC0603-DA; Temperature Range High: +125°C; Voltage: 10 V; Height: 0.9mm; Device Class L1: Passive Components; ComponentLink2Description: Datasheet; Lead Free: Yes; Octopart: https://octopart.com/cc0603krx7r6bb105-yageo-13184191; Capacitance: 1 uF; Manufacturer Part Number: CC0603KRX7R6BB105; Temperature Range Low: -55°C; RoHS: TRUE; Device Class L2: Capacitors
C7 C12 = CMP-03422-000575-1: CAP CER 10000PF 10V X7R 0603; Manufacturer: YAGEO; Tolerance: 0.1; Temperature Coefficient: 15%; Material: Ceramic; Footprint Url: http://www.yageo.com/exep/pages/download/literatures/UPY-C_GEN_24.pdf; Temperature Characteristic: X7R; Device Class L2: Capacitors; Voltage: 10 V; Octopart: https://octopart.com/cc0603krx7r6bb103-yageo-25629541; Height: 0.9mm; ComponentLink2Description: Datasheet; Manufacturer Part Number: CC0603KRX7R6BB103; Mouser Description: Cap Ceramic 0.01uF 10V X7R 10% SMD 0603 125°C Paper T/R; Voltage Rating: 10 V; Temperature Range High: +125°C; Temperature Range Low: -55°C; Capacitance: 10 nF; ComponentLink2URL: http://www.yageo.com/documents/recent/UPY-GPHC_X7R_6.3V-to-50V_18.pdf; RoHS: TRUE; Automotive: No; Device Class L1: Passive Components; Lead Free: Yes; Digikey Description: CAP CER 10000PF 10V X7R 0603; Package: CC0603-DA; Category: Cap; Temperature: -55°C to +125°C; Device Class L3: Ceramic Capacitors
C8-C10 C13 C16 = CMP-03020-019869-2: CAP CER SMD 0603 .1UF 10% X5R 10; Manufacturer: KEMET; Temperature Coefficient: 30ppm/°C; Automotive Grade: Grade 1; Tolerance: 0.1; Material: Ceramic; Voltage Rating: 10 V; Capacitance: 0.10 μF; Automotive: Yes; ComponentLink2Description: Datasheet; Device Class L2: Capacitors; ComponentLink2URL: https://api.kemet.com/component-edge/download/datasheet/C0603C100J5GACAUTO.pdf; Category: Cap; Lead Free: Yes; RoHS: TRUE; Device Class L3: Ceramic Capacitors; Device Class L1: Passive Components; Height: 0.87mm; Temperature Characteristic: X5R; Temperature Range Low: -55°C; Temperature Range High: +125°C; Digikey Description: CAP CER SMD 0603 .1UF 10% X5R 10; Octopart: https://octopart.com/c0603c104k8pac7867-kemet-90665683; Manufacturer Part Number: C0603C104K8PAC7867; Temperature: -55°C to +125°C; Package: C0603C-CF
C14 C15 = CMP-03422-000566-1: CC0603 2.2 uF X5R 10.00% 6.3 V; Manufacturer: YAGEO; Tolerance: 0.1; Material: Ceramic; Temperature Coefficient: 15%; Voltage Rating: 6.3 V; Manufacturer Part Number: CC0603KPX5R5BB225; Footprint Url: http://www.yageo.com/exep/pages/download/literatures/UPY-C_GEN_24.pdf; ComponentLink2Description: Datasheet; Device Class L2: Capacitors; Category: Cap; Lead Free: Yes; RoHS: TRUE; Package: CC0603-DA; Temperature Characteristic: X5R; Octopart: https://octopart.com/cc0603kpx5r5bb225-yageo-91091798; Height: 0.9mm; Temperature Range High: +125°C; Device Class L1: Passive Components; Temperature Range Low: -55°C; Automotive: No; Device Class L3: Ceramic Capacitors; Capacitance: 2.2 uF; Temperature: -55°C to +125°C; Voltage: 6.3 V; ComponentLink2URL: http://www.yageo.com/documents/recent/UPY-GPHC_X7R_6.3V-to-50V_18.pdf
C66 C67 = CMP-2006-01139-1: Manufacturer: Vitramon; Part Number: VJ0603A180JXAAC
C68 C69 = CMP-03020-011295-1: CAP CER 12PF 50V NP0 0603; Manufacturer: KEMET; Automotive Grade: Grade 1; Temperature Coefficient: 30ppm/°C; Tolerance: 0.25 pF; Material: Ceramic; Temperature Characteristic: C0G; Device Class L1: Passive Components; Category: Cap; Height: 0.87mm; Digikey Description: CAP CER 12PF 50V NP0 0603; Octopart: https://octopart.com/c0603c120c5gac7867-kemet-1583919; Temperature Range High: +125°C; Temperature Range Low: -55°C; Lead Free: Yes; Package: C0603C-CF; Automotive: Yes; Voltage Rating: 50 V; Temperature: -55°C to +125°C; Device Class L3: Ceramic Capacitors; ComponentLink2URL: https://api.kemet.com/component-edge/download/datasheet/C0603C100J5GACAUTO.pdf; Device Class L2: Capacitors; ComponentLink2Description: Datasheet; Capacitance: 12 pF; Manufacturer Part Number: C0603C120C5GAC7867; RoHS: TRUE
J6 = CMP-00254-12081839-1: 315-43-106-41-001000 IC & Component Sockets Interconnect Socket; Number of Positions: 6; Pitch: 2.54mm; Connector Type: Receptacle, Socket; Contact Plating: Gold; NexarPartId: 12081839; Mount: Through Hole; RoHS: Compliant; Termination: Solder; Packaging: Bulk; Color: Black; Number of Rows: 1
J7 = CMP-2000-05823-1: Micro USB, Receptacle, -55 to 85 degC, 5-Pin SMD, RoHS, Tape and Reel; Manufacturer: FCI Electronics; Connector Type: USBMicroB; Contact Termination: SurfaceMountRightAngle; Connector Mounting: PCB; No. of Contacts: 5; Manufacturer URL: http://portal.fciconnect.com/; Contact Plating: Gold; Package Description: 5-Pin Surface Mount Device, Body 8.06 x 5.6 mm, Pitch 0.65 mm; Datasheet URL: http://portal.fciconnect.com/Comergent//fci/drawing/10104110.pdf; Datasheet Version: Rev. C, 03/2011; Package Reference: 10104110-0001LF; Mounting Technology: SurfaceMount; Gender: Receptacle
P5 = Header 3: Header, 3-Pin; LatestRevisionDate: 17-Jul-2002; LatestRevisionNote: Re-released for DXP Platform.; Publisher: Altium Limited
R13-R15 = CMP-02407-003273-1: RES Thick Film, 10kΩ, 1%, 0.1W, 100ppm/°C, 0603; Max Power Dissipation: 100mW; Tolerance: 1%; Packaging: Tape and Reel; Lead Free: Lead Free; Max Operating Temperature: 155°C; Min Operating Temperature: -55°C; Package Quantity: 10000; Length: 0.061inch; Height: 0.02inch; Width: 0.033inch; Composition: Thick Film; Number of Terminations: 2; Case/Package: 0603; Features: Automotive AEC-Q200; Temperature Coefficient: 100ppm/°C
SW1 = CMP-05618-000013-1: SWITCH TACTILE SPST-NO 0.02A 15V; Manufacturer: Panasonic; Electromechanical Life: 500000Cycles; Contact Resistance: 500mΩ; Operating Force: 1.6N; Standoff Height: 0.025mm; Contact Current Rating: 20mA; Automotive: No; Digikey Description: SWITCH TACTILE SPST-NO 0.02A 15V; Octopart: https://octopart.com/evp-bb2a9b000-panasonic-75477754; Lead Free: Yes; Device Class L2: Switches; Temperature Range Low: -40°C; Temperature: -40°C to +85°C; Mount: Surface Mount; Temperature Range High: +85°C; Throw Configuration: SPST-NO; Device Class L1: Electromechanical; Height: 0.63mm; Manufacturer Part Number: EVP-BB2A9B000; Package: 0; ComponentLink2Description: Datasheet; Category: Switch; RoHS: TRUE; ComponentLink2URL: https://www3.panasonic.biz/ac/e_download/control/switch/light-touch/catalog/sw_lt_eng_2616s.pdf?f_cd=402266&via=ok; Voltage Rating Dc: 15V; Device Class L3: Tactile Switches
U2 = CMP-0243-00017-5: NexarPartId: 20570110; Manufacturer Package Identifier: 1L_ME_V5; Peripherals: Brown-out Detect/Reset, DMA, I2C, LCD, POR, PWM, WDT; Number of Programmable I/O: 82; Oscillator Type: Internal; Nominal Supply Current: 1.7µA; Number of Timers/Counters: 14; RAM Size: 192kB; Number of D/A Converters: 2; Number of Ethernet Channels: 1; Max Frequency: 168MHz; Number of SPI Channels: 3; Data Bus Width: 32b; Number of ADC Channels: 16; Max Supply Voltage: 3.6V; Number of USART Channels: 4; Interface: CAN, Ethernet, I2C, I2S, IrDA, LIN, SPI, UART, USART, USB; Max Junction Temperature (Tj): 125°C; Core Architecture: ARM Cortex-M4; Watchdog Timer: Yes; Memory Size: 1MB; Memory Type: FLASH; Min Supply Voltage: 1.8V; Number of I/Os: 82; Lead Free: Lead Free; Lifecycle Status: Production; Radiation Hardening: No; Frequency: 168MHz; Max Operating Temperature: 85°C; Height: 1.45mm; Number of Pins: 100; Number of I2C Channels: 3; Number of USB Channels: 1; REACH SVHC: No SVHC; Length: 14.2mm; Ambient Temperature Range High: 85°C; Schedule B: 8542310000, 8542310000; Number of Channels: 16; Number of A/D Converters: 3; Width: 14.2mm; Case/Package: LQFP; Flash Memory Size: 1MB; Min Operating Temperature: -40°C; Address Bus Width: 32b; Number of UART Channels: 2; RoHS: Compliant; Number of PWM Channels: 2
Y1 = CMP-27762-001275-1: Crystal 25MHz ±20ppm 18pF SMD-4 3.2mm x 2.5mm; ESR (Equivalent Series Resistance): 50R; Frequency Stability: 50ppm; Frequency Tolerance: 20ppm; Length: 0.126inch; Min Operating Temperature: -20°C; Width: 0.098inch; Series: ABM8; Load Capacitance: 18pF; Packaging: Tape and Reel; Case/Package: SMD/SMT; Max Operating Temperature: 70°C; Mount: Surface Mount; Height: 0.031inch; Frequency: 25MHz
Y2 = CMP-27762-005385-1: CRYSTAL 32.7680KHZ 12.5PF SMD; ESR (Equivalent Series Resistance): 70kR; Tolerance: 10ppm; Package Quantity: 3000; Lead Free: Lead Free; Frequency: 32.768kHz; Load Capacitance: 12.5pF; Series Resistance: 70kR; Series: ABS09; Min Operating Temperature: -40°C; Frequency Tolerance: 10ppm; Packaging: Tape and Reel; Termination: SMD/SMT; RoHS Compliant: Yes; Width: 1.5mm; Number of Pins: 2; Case/Package: CSMD; Mount: Surface Mount; Height: 0.035inch; Length: 4.1mm; Depth: 1.5mm; Max Operating Temperature: 85°C

## Sheet Peripherals.SchDoc
size A4; SheetNumber: 6; SheetTotal: 9
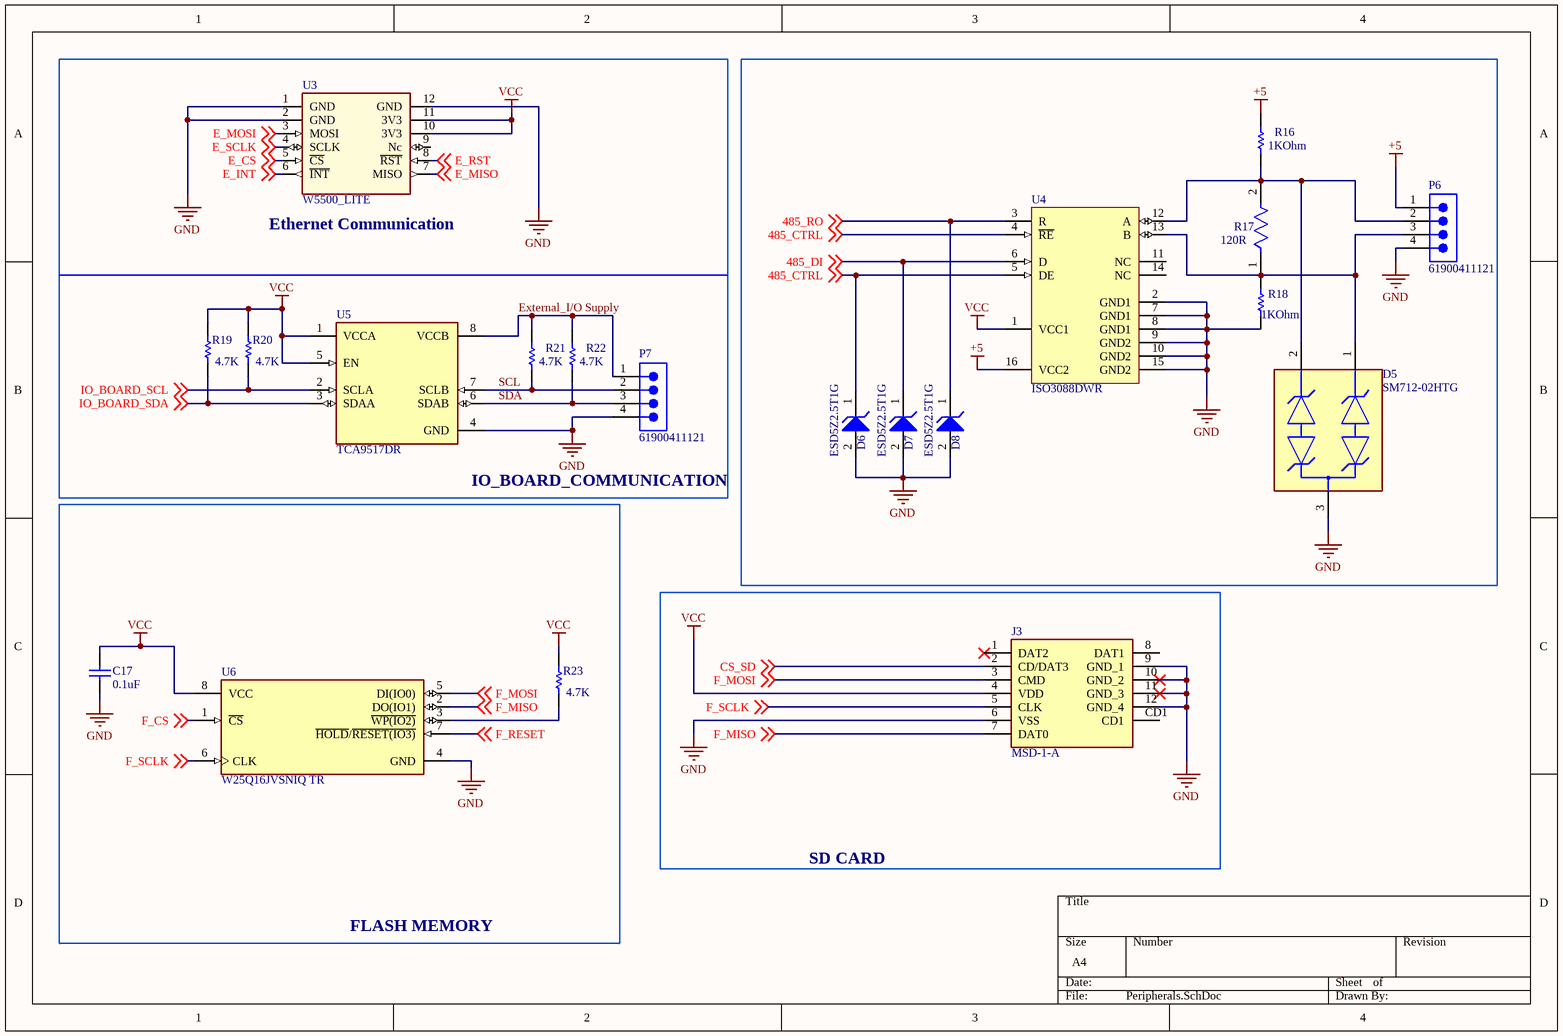
[diagram p5: Peripherals.SchDoc]

### Parts
C17  0.1uF  [CAPC1608X92X38ML15T08]
D5  SM712-02HTG  [FP-SM712-MFG]
D6  ESD5Z2.5T1G  [ONSC-SOD-523-2-502-01_V]
D7  ESD5Z2.5T1G  [ONSC-SOD-523-2-502-01_V]
D8  ESD5Z2.5T1G  [ONSC-SOD-523-2-502-01_V]
J3  MSD-1-A  [MSD1A]
P6  61900411121  [61900411121]
P7  61900411121  [61900411121]
R16  Resistance: 1KOhm  [RESC2013X60X35ML10T20]  (hidden comment: RC0805FR-071KL)
R17  Resistance: 120R  [FP-CRCW0805-e3-MFG]  (hidden comment: CRCW0805120RFKEA)
R18  Resistance: 1KOhm  [RESC2013X60X35ML10T20]  (hidden comment: RC0805FR-071KL)
R19  Resistance: 4.7K  [YAGO-RC0805_M]  (hidden comment: RC0805FR-074K7L)
R20  Resistance: 4.7K  [YAGO-RC0805_M]  (hidden comment: RC0805FR-074K7L)
R21  Resistance: 4.7K  [YAGO-RC0805_M]  (hidden comment: RC0805FR-074K7L)
R22  Resistance: 4.7K  [YAGO-RC0805_M]  (hidden comment: RC0805FR-074K7L)
R23  Resistance: 4.7K  [YAGO-RC0805_M]  (hidden comment: RC0805FR-074K7L)
U3  W5500_LITE  [W5500]
U4  ISO3088DWR  [DW0016B_N]
U5  TCA9517DR  [FP-D0008A-MFG]
U6  W25Q16JVSNIQ TR  [FP-W25Q16JVSNIQ_TR-IPC_A]

### Blocks framed on the sheet
SD CARD: J3

### Nets
+5: P6.1 R16.2 U4.16(VCC2)
GND: C17.1 D5.3 D6.2(A) D7.2(A) D8.2(A) J3.6(VSS) J3.9(GND_1) J3.10(GND_2) J3.11(GND_3) J3.12(GND_4) P6.4 P7.4 R18.1 U3.1(GND) U3.2(GND) U3.12(GND) U4.2(GND1) U4.7(GND1) U4.8(GND1) U4.9(GND2) U4.10(GND2) U4.15(GND2) U5.4(GND) U6.4(GND)
VCC: C17.2 J3.4(VDD) R19.2 R20.2 R23.2 U3.10(3V3) U3.11(3V3) U4.1(VCC1) U5.1(VCCA) U5.5(EN) U6.8(VCC)
485_CTRL: D6.1(K) U4.4(~{RE}) U4.5(DE) ; off-sheet 485_CTRL
485_DI: D7.1(K) U4.6(D) ; off-sheet 485_DI
485_RO: D8.1(K) U4.3(R) ; off-sheet 485_RO
CS_SD: J3.2(CD/DAT3) ; off-sheet CS_SD
E_CS: U3.5(~{CS}) ; off-sheet E_CS
E_INT: U3.6(~{INT}) ; off-sheet E_INT
E_MISO: U3.7(MISO) ; off-sheet E_MISO
E_MOSI: U3.3(MOSI) ; off-sheet E_MOSI
E_RST: U3.8(~{RST}) ; off-sheet E_RST
E_SCLK: U3.4(SCLK) ; off-sheet E_SCLK
External_I/O Supply: P7.1 R21.2 R22.2 U5.8(VCCB)
F_CS: U6.1(~{CS}) ; off-sheet F_CS
F_MISO: J3.7(DAT0) U6.2(DO(IO1)) ; off-sheet F_MISO
F_MOSI: J3.3(CMD) U6.5(DI(IO0)) ; off-sheet F_MOSI
F_RESET: U6.7(~{HOLD}/~{RESET(IO3)}) ; off-sheet F_RESET
F_SCLK: J3.5(CLK) U6.6(CLK) ; off-sheet F_SCLK
IO_BOARD_SCL: R20.1 U5.2(SCLA) ; off-sheet IO_BOARD_SCL
IO_BOARD_SDA: R19.1 U5.3(SDAA) ; off-sheet IO_BOARD_SDA
SCL: P7.2 R21.1 U5.7(SCLB)
SDA: P7.3 R22.1 U5.6(SDAB)
NetD5_1: D5.1 P6.3 R17.1 R18.2 U4.13(B)
NetD5_2: D5.2 P6.2 R16.1 R17.2 U4.12(A)
NetR23_1: R23.1 U6.3(~{WP(IO2)})

Not connected (* = marked no-connect by the designer): J3 1(DAT2)* 8(DAT1) CD1; U3 9(Nc); U4 11(NC) 14(NC)

### Notes on the sheet
- (near U3) Ethernet Communication
- IO_BOARD_COMMUNICATION
- FLASH MEMORY

### Library data of the parts
C17 = CMP-2006-01211-1: Manufacturer: Vitramon; Part Number: VJ0603Y104KXJAP
D5 = CMP-2000-07561-2: TVS DIODE 12V 31V SOT23-3; Leakage Current: 20uA; Polarity: Bidirectional; Breakdown Voltage: 13.3V; Max Power Dissipation: 600W; Number of Channels: 2; Max Surge Current: 19A; Capacitance: 75pF; Power Line Protection: No; Element Configuration: Dual; Number of Pins: 3; Radiation Hardening: No; Clamping Voltage: 31V; Mount: Surface Mount; Reverse Standoff Voltage: 12V; Peak Pulse Power: 600W; Lead Free: Lead Free; Direction: Bidirectional; Packaging: Tape and Reel; Case/Package: SOT-23-3; Number of Bidirectional Channels: 2; Termination: SMD/SMT; Max Operating Temperature: 125°C; Min Breakdown Voltage: 13.3V; Depth: 1.4mm; Package Quantity: 3000; Working Voltage: 12V; Length: 3.04mm; Peak Pulse Current: 19A; Composition: Zener; Min Operating Temperature: -40°C
D6-D8 = CMP-1063-00103-1: Transient Voltage Suppressor, Micro-Packaged Diode for ESD Protection, 2-Pin SOD-523, Pb-Free, Tape and Reel; Manufacturer: On Semiconductor; Direction: Unidirectional; PPK Max (W): 120; V(BR) Min (V): 4; VRWM Max (V): 2.5; Number of Lines: 1; IR Max (uA): 6; ComponentLink3Description: Package Specification; Packing: Tape and Reel; ComponentLink2URL: http://www.onsemi.cn/pub_link/Collateral/ESD5Z2.5T1-D.PDF; ComponentLink3URL: http://www.onsemi.com/pub_link/Collateral/502-01.PDF; PackageReference: SOD-523-2-502-01; PartNumber: ESD5Z2.5T1G; Mounting Technology: Surface Mount; DatasheetVersion: Rev. 10; PackageVersion: Rev. E, 09/2010; RoHS: Pb-Free; ComponentLink1Description: Manufacturer URL; PackageDescription: 2-Pin SOD, Body 1.2 x 0.8 mm; ComponentLink2Description: Datasheet; ComponentLink1URL: http://www.onsemi.com/
J3 = MSD-1-A: Micro SD Card Connector, 9 Positions, Connector and Ejector, Push In, Auto Eject Out, Surface Mount, 1.8 mm Height Above Board, Gold Flash; Manufacturer_Name: Same Sky; Geometry.Height: 2mm; Mouser Part Number: 179-MSD-1-A; Mouser Price/Stock: https://www.mouser.co.uk/ProductDetail/Same-Sky/MSD-1-A?qs=Z%252BL2brAPG1Ip18XLC4tUPQ%3D%3D; Manufacturer_Part_Number: MSD-1-A; Datasheet Link: https://www.sameskydevices.com/product/resource/msd-1-a.pdf
P6 P7 = CMP-1502-00586-2: NexarPartId: 18818226; Connector Type: Male Pin; Insulation: Insulated; Number of Positions: 4; Gender: Male; Operating Supply Voltage: 250V; Pitch: 2.54mm; Current Rating: 3A; Insulation Resistance: 1GΩ; Contact Resistance: 20mΩ; Termination: Through Hole; Contact Material: Copper; Height: 3.3mm; Width: 10.2mm; RoHS: Compliant; REACH SVHC: Unknown; Max Operating Temperature: 105°C; Contact Plating: Tin; Lead Free: Lead Free; Contact Gender: Male; Lead Pitch: 2.54mm; Flammability Rating: UL94 V-0; Packaging: Bulk; Housing Material: Nylon; Number of Pins: 4; Number of Contacts: 4; Color: Beige; Number of Rows: 1; Orientation: Vertical; Contact Mating Length: 7.493mm; Mount: Through Hole; Min Operating Temperature: -40°C; Voltage Rating: 250V; Fastening Type: Friction; Length: 10.16mm
R16 R18 = CMP-2100-03671-1: Chip Resistor, 1 KOhm, +/- 1%, 125 mW, -55 to 155 degC, 0805 (2012 Metric), RoHS, Tape and Reel; Manufacturer: Yageo; Temperature Coefficient: 100ppm/degreesC; Voltage Rating (DC): 150V; Max Power Dissipation: 125mW; Number of Pins: 2; Number of Terminations: 2; Datasheet URL: http://www.yageo.com/NewPortal/yageodocoutput?fileName=/pdf/R-Chip/PYu-RC_Group_51_RoHS_L_5.pdf; Length: 0.079inch; Package Description: 2-Pin Surface Mounted Device, Body 2 x 1.25 mm; Depth: 1.25mm; Height: 0.024inch; Military Standard: Not; Case/Package: 0805; Package Reference: 0805; RoHSCompliant: true; Lead Free: LeadFree; Packaging: TapeandReel; Package Quantity: 1; Datasheet Version: Rev. 5, 10/2016; Tolerance: 1%; Min Operating Temperature: -55degC; Voltage Rating: 150V; Composition: ThickFilm; Case Code (Imperial): 0805; Power Rating: 125mW; Width: 0.049inch; Case Code (Metric): 2012; Manufacturer URL: http://www.yageo.com/; Max Operating Temperature: 155degC; REACH SVHC: Unknown; Termination: SMD/SMT
R17 = CMP-02407-007854-1: RES Thick Film, 120Ω, 1%, 0.125W, 100ppm/°C, 0805; Voltage Rating (DC): 150V; Max Power Dissipation: 125mW; Height: 0.45mm; Min Operating Temperature: -55°C; Packaging: Tape and Reel; Package Quantity: 10; Width: 1.25mm; Weight: 0.000194oz; Termination: SMD/SMT; Mount: Surface Mount; Tolerance: 1%; Military Standard: Not; Max Operating Temperature: 155°C; Lead Free: Lead Free; Number of Terminations: 2; Radiation Hardening: No; Temperature Coefficient: 100ppm/°C; Length: 2mm; Case/Package: 0805; Voltage Rating: 150V; Case Code (Metric): 2012; Case Code (Imperial): 0805; Features: Automotive AEC-Q200; Composition: Thick Film; Contact Plating: Tin; Power Rating: 125mW; Depth: 1.25mm
R19-R23 = CMP-1568-00001-1: General Puprose Chip Resistor, 4700 Ohm +/- 1%, 0.125 W, -55 to 155 degC, 2-Pin SMD, RoHS, Tape and Reel; Tolerance: +/- 1%; Power: 0.125 W; PackageDescription: 2-Pin Surface Mount Device, Body 2 x 1.25 mm; ComponentLink2URL: http://www.yageo.com/documents/recent/PYu-RC_Group_51_RoHS_L-3.pdf; Temperature Min: -55 degC; Packing: Tape and Reel; Mounting Technology: Surface Mount; PartNumber: RC0805FR-074K7L; ComponentLink1URL: http://www.yageo.com/NewPortal/_en/index.jsp; Temperature Max: 155 degC; ComponentLink2Description: Datasheet; DatasheetVersion: Rev. 3; RoHS: TRUE; ComponentLink1Description: Manufacturer URL
U3 = W5500
U4 = CMP-0316-00040-2: Isolated RS-485 Transceiver, 20 Mbps, 5 V, Half Duplex, -40 to 85 degC, 16-pin SOIC (DW); Manufacturer: Texas Instruments; Rating: Catalog; ICC(Max)(mA): 15; Fail Safe: Idle, Open, Short; # of TX/RX: 1 TX / 1 RX; Drivers Per Package: 1; Signaling Rate(Mbps): 20; Common Mode Range: -7 to 12; ESD(kV): 16; Supply Voltage(s)(V): 5; Eco-Plan: TBD; Fault Protection(V): -9 to 14; Number of Nodes: 256; Isolated: Yes; Mounting Technology: Surface Mount; PackageVersion: revG, Jan-2011; PartNumber: ISO3088DWR; PackageDescription: 16-Pin Small Outline Integrated Circuit, 10.3 x 7.5 mm, Pitch 1.27 mm Pitch; ComponentLink2Description: Package Specification; SubFamily: RS-485; Duplex: Half; ComponentLink1URL: http://www.ti.com/general/docs/lit/getliterature.tsp?genericPartNumber=ISO3088&fileType=pdf; ComponentLink2URL: http://www.ti.com/litv/pdf/msoi003g; DatasheetVersion: SLOS581E; PackageReference: DW0016B; Code_JEDEC: MS-013-AA; Receivers Per Package: 1; ComponentLink1Description: Datasheet
U5 = CMP-04881-000005-1: IC TRNSLTR BIDIRECTIONAL 8SOIC; Propagation Delay: 110ns; Number of Bits: 2; Min Supply Voltage: 900mV; Output Type: Voltage; Max Supply Voltage: 5.5V; Interface: I2C; Input Capacitance: 8pF; Max Frequency: 400kHz; Number of Circuits: 1; Turn-On Delay Time: 141ns; Logic Function: Translator; Max Operating Temperature: 85°C; Channel Type: Bidirectional; Radiation Hardening: No; Case/Package: SOIC; REACH SVHC: No SVHC; Contact Plating: Gold; Packaging: Tape and Reel; Package Quantity: 2500; Mount: Surface Mount; Number of Pins: 8; Min Operating Temperature: -40°C; Number of Outputs: 2; Number of Channels: 2; Lead Free: Lead Free
U6 = CMP-78876-000009-2: IC FLASH 16MBIT SPI/QUAD 8SOIC; NexarPartId: 75645707; Max Supply Voltage: 3.6V; Memory Size: 2MB; Interface: SPI; Access Time: 5ms; Min Supply Voltage: 2.7V; RoHS: Non-Compliant; Min Operating Temperature: -40°C; Memory Type: FLASH; Height: 1.75mm; Schedule B: 8542320070, 8542320070; Ambient Temperature Range High: 85°C; Max Operating Temperature: 85°C